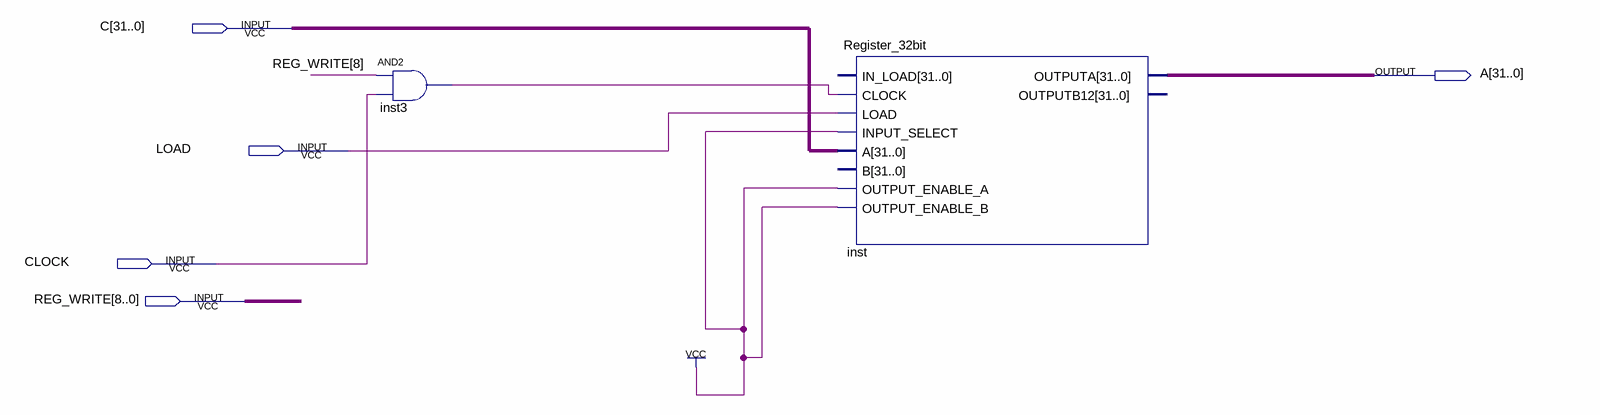
[diagram p0: schematic sheet]
// Quartus schematic H.bdf as structural Verilog: 2 symbols, 5 pins
module H (
  input  [31:0] C,
  input  LOAD,
  input  CLOCK,
  input  [8:0] REG_WRITE,
  output [31:0] A
);

  wire inst3_out;

  and inst3 (inst3_out, REG_WRITE[8], CLOCK);
  Register_32bit inst (
    .CLOCK(inst3_out), .LOAD(LOAD), .INPUT_SELECT(1'b1), .A(C), .OUTPUT_ENABLE_A(1'b1),
    .OUTPUT_ENABLE_B(1'b1), .OUTPUTA(A));  // open: IN_LOAD, B, OUTPUTB12
endmodule
